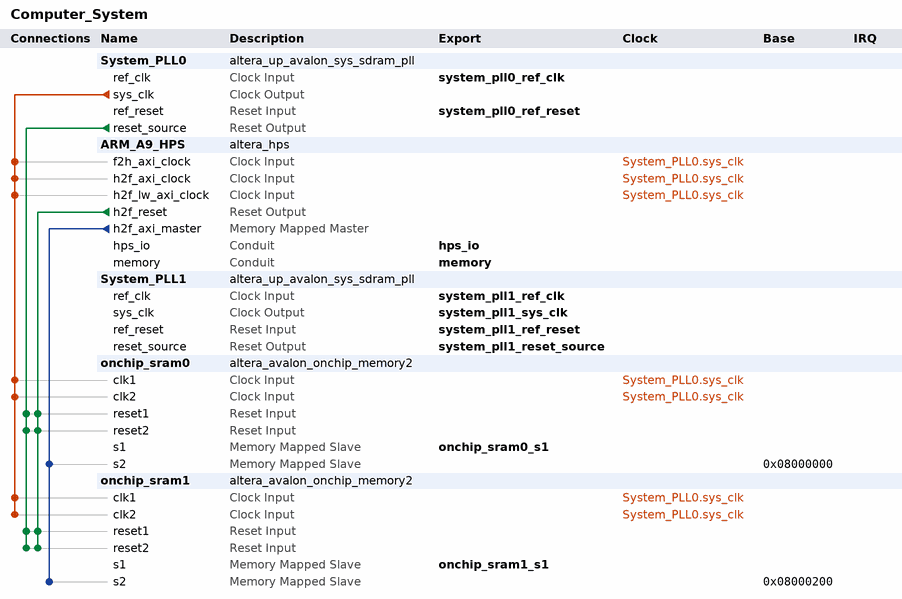
[diagram p0: system contents]
# Platform Designer (Qsys) system Computer_System, Cyclone V 5CSEMA5F31C6
# Parameters at their usual value, and those the tool derives, are not listed.
package require -exact qsys 18.1
create_system Computer_System
set_project_property DEVICE_FAMILY {Cyclone V}
set_project_property DEVICE 5CSEMA5F31C6

add_instance System_PLL0 altera_up_avalon_sys_sdram_pll 18.0
set_instance_parameter_value System_PLL0 CV_boards DE1-SoC
set_instance_parameter_value System_PLL0 gui_outclk 100.0
set_instance_parameter_value System_PLL0 gui_refclk 50.0

add_instance ARM_A9_HPS altera_hps 18.1
set_instance_parameter_value ARM_A9_HPS EMAC1_Mode RGMII
set_instance_parameter_value ARM_A9_HPS EMAC1_PinMuxing {HPS I/O Set 0}
set_instance_parameter_value ARM_A9_HPS F2SCLK_COLDRST_Enable false
set_instance_parameter_value ARM_A9_HPS F2SCLK_DBGRST_Enable false
set_instance_parameter_value ARM_A9_HPS F2SCLK_WARMRST_Enable false
set_instance_parameter_value ARM_A9_HPS F2SINTERRUPT_Enable true
set_instance_parameter_value ARM_A9_HPS F2S_Width 3
set_instance_parameter_value ARM_A9_HPS FPGA_PERIPHERAL_OUTPUT_CLOCK_FREQ_EMAC0_GTX_CLK 125
set_instance_parameter_value ARM_A9_HPS FPGA_PERIPHERAL_OUTPUT_CLOCK_FREQ_EMAC0_MD_CLK 100.0
set_instance_parameter_value ARM_A9_HPS FPGA_PERIPHERAL_OUTPUT_CLOCK_FREQ_EMAC1_GTX_CLK 125
set_instance_parameter_value ARM_A9_HPS FPGA_PERIPHERAL_OUTPUT_CLOCK_FREQ_EMAC1_MD_CLK 100.0
set_instance_parameter_value ARM_A9_HPS HPS_PROTOCOL DDR3
set_instance_parameter_value ARM_A9_HPS I2C0_Mode I2C
set_instance_parameter_value ARM_A9_HPS I2C0_PinMuxing {HPS I/O Set 0}
set_instance_parameter_value ARM_A9_HPS I2C1_Mode I2C
set_instance_parameter_value ARM_A9_HPS I2C1_PinMuxing {HPS I/O Set 0}
set_instance_parameter_value ARM_A9_HPS LWH2F_Enable true
set_instance_parameter_value ARM_A9_HPS MEM_BANKADDR_WIDTH 3
set_instance_parameter_value ARM_A9_HPS MEM_CLK_FREQ 400.0
set_instance_parameter_value ARM_A9_HPS MEM_COL_ADDR_WIDTH 10
set_instance_parameter_value ARM_A9_HPS MEM_DQ_WIDTH 32
set_instance_parameter_value ARM_A9_HPS MEM_DRV_STR RZQ/7
set_instance_parameter_value ARM_A9_HPS MEM_ROW_ADDR_WIDTH 15
set_instance_parameter_value ARM_A9_HPS MEM_RTT_NOM RZQ/4
set_instance_parameter_value ARM_A9_HPS MEM_RTT_WR RZQ/4
set_instance_parameter_value ARM_A9_HPS MEM_TCL 11
set_instance_parameter_value ARM_A9_HPS MEM_TFAW_NS 30.0
set_instance_parameter_value ARM_A9_HPS MEM_TRAS_NS 35.0
set_instance_parameter_value ARM_A9_HPS MEM_TRCD_NS 13.75
set_instance_parameter_value ARM_A9_HPS MEM_TRFC_NS 260.0
set_instance_parameter_value ARM_A9_HPS MEM_TRP_NS 13.75
set_instance_parameter_value ARM_A9_HPS MEM_VENDOR JEDEC
set_instance_parameter_value ARM_A9_HPS MEM_WTCL 8
set_instance_parameter_value ARM_A9_HPS QSPI_Mode {1 SS}
set_instance_parameter_value ARM_A9_HPS QSPI_PinMuxing {HPS I/O Set 0}
set_instance_parameter_value ARM_A9_HPS REF_CLK_FREQ 25.0
set_instance_parameter_value ARM_A9_HPS S2FCLK_USER2CLK 5
set_instance_parameter_value ARM_A9_HPS S2F_Width 3
set_instance_parameter_value ARM_A9_HPS SDIO_Mode {4-bit Data}
set_instance_parameter_value ARM_A9_HPS SDIO_PinMuxing {HPS I/O Set 0}
set_instance_parameter_value ARM_A9_HPS SPIM1_Mode {Single Slave Select}
set_instance_parameter_value ARM_A9_HPS SPIM1_PinMuxing {HPS I/O Set 0}
set_instance_parameter_value ARM_A9_HPS STM_Enable false
set_instance_parameter_value ARM_A9_HPS TIMING_BOARD_AC_SKEW 0.03
set_instance_parameter_value ARM_A9_HPS TIMING_BOARD_AC_TO_CK_SKEW 0.0
set_instance_parameter_value ARM_A9_HPS TIMING_BOARD_DQ_TO_DQS_SKEW 0.0
set_instance_parameter_value ARM_A9_HPS TIMING_BOARD_MAX_CK_DELAY 0.03
set_instance_parameter_value ARM_A9_HPS TIMING_BOARD_MAX_DQS_DELAY 0.02
set_instance_parameter_value ARM_A9_HPS TIMING_BOARD_SKEW_BETWEEN_DQS 0.08
set_instance_parameter_value ARM_A9_HPS TIMING_BOARD_SKEW_CKDQS_DIMM_MAX 0.16
set_instance_parameter_value ARM_A9_HPS TIMING_BOARD_SKEW_CKDQS_DIMM_MIN 0.09
set_instance_parameter_value ARM_A9_HPS TIMING_BOARD_SKEW_WITHIN_DQS 0.01
set_instance_parameter_value ARM_A9_HPS TIMING_TDH 65
set_instance_parameter_value ARM_A9_HPS TIMING_TDQSCK 255
set_instance_parameter_value ARM_A9_HPS TIMING_TDQSQ 125
set_instance_parameter_value ARM_A9_HPS TIMING_TDS 30
set_instance_parameter_value ARM_A9_HPS TIMING_TIH 140
set_instance_parameter_value ARM_A9_HPS TIMING_TIS 180
set_instance_parameter_value ARM_A9_HPS TIMING_TQSH 0.4
set_instance_parameter_value ARM_A9_HPS UART0_Mode {No Flow Control}
set_instance_parameter_value ARM_A9_HPS UART0_PinMuxing {HPS I/O Set 0}
set_instance_parameter_value ARM_A9_HPS USB1_Mode SDR
set_instance_parameter_value ARM_A9_HPS USB1_PinMuxing {HPS I/O Set 0}
set_instance_parameter_value ARM_A9_HPS desired_cfg_clk_mhz 100.0
set_instance_parameter_value ARM_A9_HPS desired_qspi_clk_mhz 400.0

add_instance System_PLL1 altera_up_avalon_sys_sdram_pll 18.0
set_instance_parameter_value System_PLL1 CV_boards DE1-SoC
set_instance_parameter_value System_PLL1 gui_outclk 100.0
set_instance_parameter_value System_PLL1 gui_refclk 50.0

add_instance onchip_sram0 altera_avalon_onchip_memory2 18.1
set_instance_parameter_value onchip_sram0 blockType M10K
set_instance_parameter_value onchip_sram0 dataWidth 256
set_instance_parameter_value onchip_sram0 dualPort true
set_instance_parameter_value onchip_sram0 enableDiffWidth true
set_instance_parameter_value onchip_sram0 initMemContent true
set_instance_parameter_value onchip_sram0 initializationFileName onchip_mem.hex
set_instance_parameter_value onchip_sram0 memorySize 512

add_instance onchip_sram1 altera_avalon_onchip_memory2 18.1
set_instance_parameter_value onchip_sram1 blockType M10K
set_instance_parameter_value onchip_sram1 dataWidth 256
set_instance_parameter_value onchip_sram1 dualPort true
set_instance_parameter_value onchip_sram1 enableDiffWidth true
set_instance_parameter_value onchip_sram1 initMemContent true
set_instance_parameter_value onchip_sram1 initializationFileName onchip_mem.hex
set_instance_parameter_value onchip_sram1 memorySize 512

# connections
add_connection System_PLL0.sys_clk ARM_A9_HPS.f2h_axi_clock clock
add_connection System_PLL0.sys_clk ARM_A9_HPS.h2f_axi_clock clock
add_connection System_PLL0.sys_clk ARM_A9_HPS.h2f_lw_axi_clock clock
add_connection System_PLL0.sys_clk onchip_sram0.clk1 clock
add_connection System_PLL0.sys_clk onchip_sram0.clk2 clock
add_connection System_PLL0.sys_clk onchip_sram1.clk1 clock
add_connection System_PLL0.sys_clk onchip_sram1.clk2 clock
add_connection ARM_A9_HPS.h2f_reset onchip_sram0.reset1 reset
add_connection ARM_A9_HPS.h2f_reset onchip_sram0.reset2 reset
add_connection ARM_A9_HPS.h2f_reset onchip_sram1.reset1 reset
add_connection ARM_A9_HPS.h2f_reset onchip_sram1.reset2 reset
add_connection System_PLL0.reset_source onchip_sram0.reset1 reset
add_connection System_PLL0.reset_source onchip_sram0.reset2 reset
add_connection System_PLL0.reset_source onchip_sram1.reset1 reset
add_connection System_PLL0.reset_source onchip_sram1.reset2 reset
add_connection ARM_A9_HPS.h2f_axi_master onchip_sram0.s2 avalon
set_connection_parameter_value ARM_A9_HPS.h2f_axi_master/onchip_sram0.s2 baseAddress 0x08000000
add_connection ARM_A9_HPS.h2f_axi_master onchip_sram1.s2 avalon
set_connection_parameter_value ARM_A9_HPS.h2f_axi_master/onchip_sram1.s2 baseAddress 0x08000200

# exported interfaces
add_interface hps_io conduit end
set_interface_property hps_io EXPORT_OF ARM_A9_HPS.hps_io
add_interface memory conduit end
set_interface_property memory EXPORT_OF ARM_A9_HPS.memory
add_interface onchip_sram0_s1 avalon slave
set_interface_property onchip_sram0_s1 EXPORT_OF onchip_sram0.s1
add_interface onchip_sram1_s1 avalon slave
set_interface_property onchip_sram1_s1 EXPORT_OF onchip_sram1.s1
add_interface system_pll0_ref_clk clock sink
set_interface_property system_pll0_ref_clk EXPORT_OF System_PLL0.ref_clk
add_interface system_pll0_ref_reset reset sink
set_interface_property system_pll0_ref_reset EXPORT_OF System_PLL0.ref_reset
add_interface system_pll1_ref_clk clock sink
set_interface_property system_pll1_ref_clk EXPORT_OF System_PLL1.ref_clk
add_interface system_pll1_ref_reset reset sink
set_interface_property system_pll1_ref_reset EXPORT_OF System_PLL1.ref_reset
add_interface system_pll1_reset_source reset source
set_interface_property system_pll1_reset_source EXPORT_OF System_PLL1.reset_source
add_interface system_pll1_sys_clk clock source
set_interface_property system_pll1_sys_clk EXPORT_OF System_PLL1.sys_clk

set_interconnect_requirement {$system} qsys_mm.clockCrossingAdapter HANDSHAKE
set_interconnect_requirement {$system} qsys_mm.enableEccProtection FALSE
set_interconnect_requirement {$system} qsys_mm.insertDefaultSlave FALSE
set_interconnect_requirement {$system} qsys_mm.maxAdditionalLatency 1

save_system Computer_System.qsys
